# Altium project Dashcam.PrjPcb (part 8 of 8)

## Sheet MICROSD.SchDoc
size A4; SheetNumber: 22; SheetTotal: 22
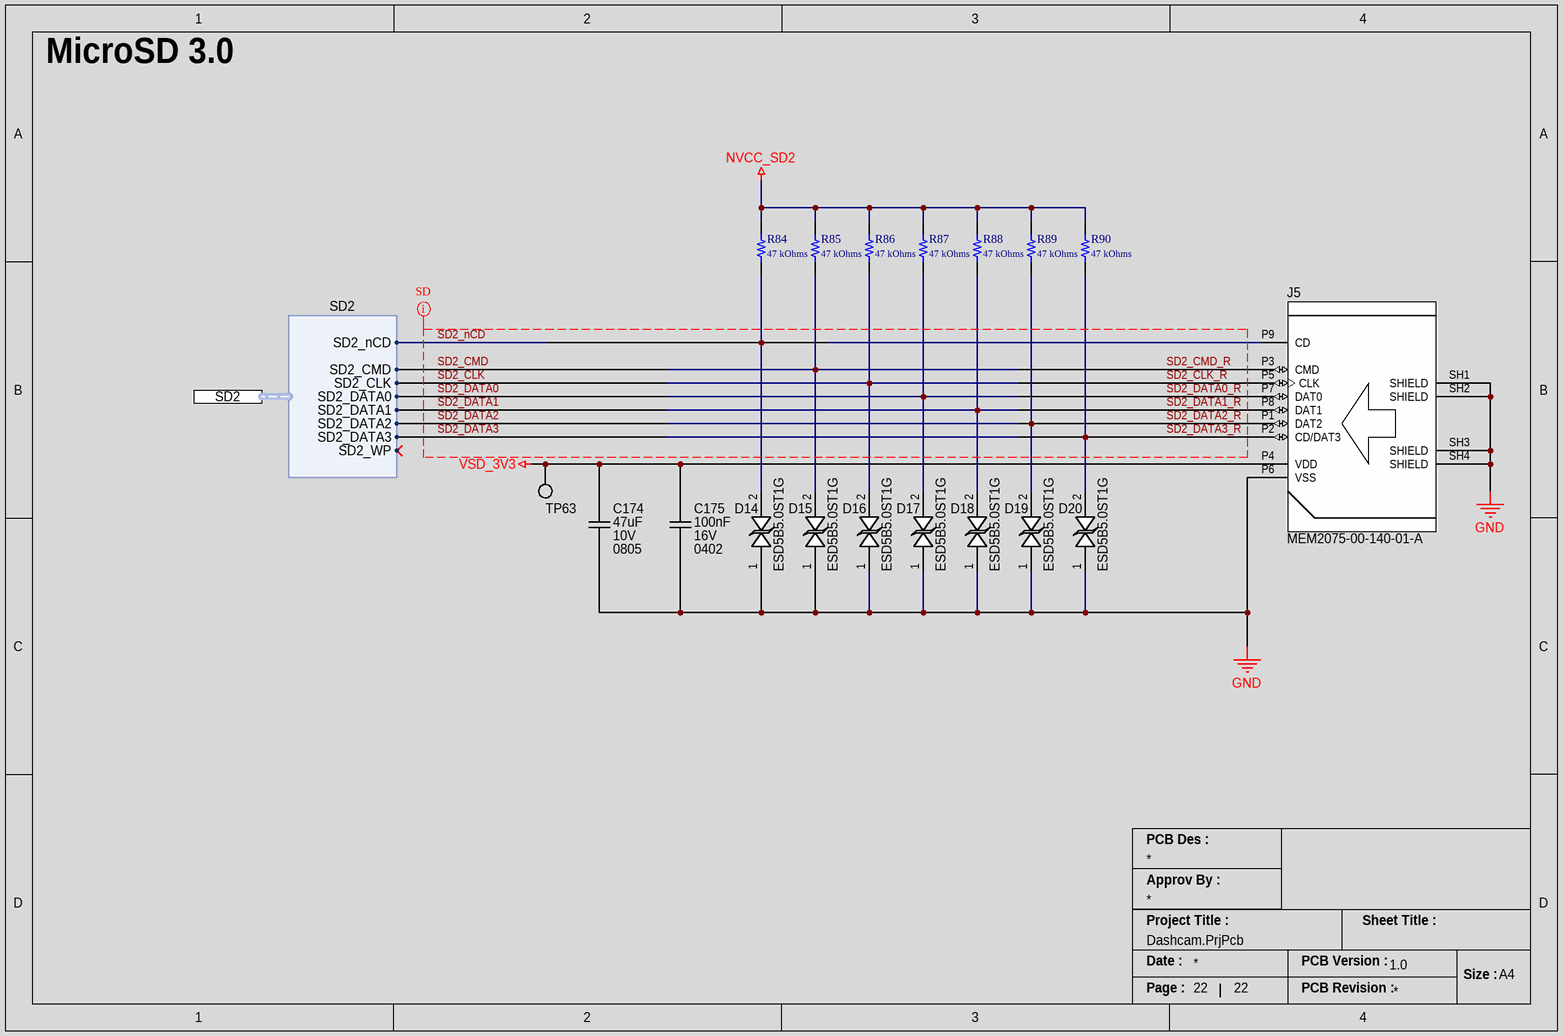
[diagram p20: MICROSD.SchDoc]

### Parts
C174  Voltage Rating (DC): 10V  Capacitance: 47uF  Case Code (Imperial): 0805  [CAP_0805_CAPC2012X12N]  (hidden comment: C2012X5R1A476M125AC)
C175  Voltage Rating: 16V  Capacitance: 100nF  Case/Package: 0402  [CAP_0402_CAPC1005X05N]  (hidden comment: CL05B104KO5NNNC)
D14  ESD5B5.0ST1G  [DIO_TVS_SODFL1608X70N]
D15  ESD5B5.0ST1G  [DIO_TVS_SODFL1608X70N]
D16  ESD5B5.0ST1G  [DIO_TVS_SODFL1608X70N]
D17  ESD5B5.0ST1G  [DIO_TVS_SODFL1608X70N]
D18  ESD5B5.0ST1G  [DIO_TVS_SODFL1608X70N]
D19  ESD5B5.0ST1G  [DIO_TVS_SODFL1608X70N]
D20  ESD5B5.0ST1G  [DIO_TVS_SODFL1608X70N]
J5  MEM2075-00-140-01-A  [CONN_MICROSD_GCT_MEM2075-00-140-01-A]
R84  47 kOhms  [YAGEO RES 0402_1005]
R85  47 kOhms  [YAGEO RES 0402_1005]
R86  47 kOhms  [YAGEO RES 0402_1005]
R87  47 kOhms  [YAGEO RES 0402_1005]
R88  47 kOhms  [YAGEO RES 0402_1005]
R89  47 kOhms  [YAGEO RES 0402_1005]
R90  47 kOhms  [YAGEO RES 0402_1005]
TP63  NO COMPONENT  [TP_PAD_0.5MM_SMD_ROUND]  (value not drawn)  (no BOM)

### Ports
SD2 (harness SD2)

### Harnesses
SD2: SD2_nCD, SD2_CMD, SD2_CLK, SD2_DATA0, SD2_DATA1, SD2_DATA2, SD2_DATA3, SD2_WP

### Nets
GND: C174.1 C175.1 D14.1(A1) D15.1(A1) D16.1(A1) D17.1(A1) D18.1(A1) D19.1(A1) D20.1(A1) J5.P6(VSS) J5.SH1(SHIELD) J5.SH2(SHIELD) J5.SH3(SHIELD) J5.SH4(SHIELD)
NVCC_SD2: R84.2 R85.2 R86.2 R87.2 R88.2 R89.2 R90.2
VSD_3V3: C174.2 C175.2 J5.P4(VDD) TP63.1
SD2_CLK: D16.2(A2) J5.P5(CLK) R86.1 ; port SD2.SD2_CLK  [also labelled SD2_CLK_R]
SD2_CMD: D15.2(A2) J5.P3(CMD) R85.1 ; port SD2.SD2_CMD  [also labelled SD2_CMD_R]
SD2_DATA0: D17.2(A2) J5.P7(DAT0) R87.1 ; port SD2.SD2_DATA0  [also labelled SD2_DATA0_R]
SD2_DATA1: D18.2(A2) J5.P8(DAT1) R88.1 ; port SD2.SD2_DATA1  [also labelled SD2_DATA1_R]
SD2_DATA2: D19.2(A2) J5.P1(DAT2) R89.1 ; port SD2.SD2_DATA2  [also labelled SD2_DATA2_R]
SD2_DATA3: D20.2(A2) J5.P2(CD/DAT3) R90.1 ; port SD2.SD2_DATA3  [also labelled SD2_DATA3_R]
SD2_nCD: D14.2(A2) J5.P9(CD) R84.1 ; port SD2.SD2_nCD

### Layout directives
net class MICROSD: SD2_CLK, SD2_CLK_R, SD2_CMD, SD2_CMD_R, SD2_DATA0, SD2_DATA0_R, SD2_DATA1, SD2_DATA1_R, SD2_DATA2, SD2_DATA2_R, SD2_DATA3, SD2_DATA3_R, SD2_nCD

### Notes on the sheet
- MicroSD 3.0
- (near J5) Micro-SD
- (near J5) # Push-Push
- PCB Des :
- Approv By :
- Project Title :
- Sheet Title :
- Date :
- PCB Version :
- Size :
- A4
- Page :
- PCB Revision :

### Library data of the parts
C174 = CAP_47UF_10V_X5R_0805: Multilayer Ceramic Capacitor, 47 uF, 10 V, ± 20%, X5R, 0805 [2012 Metric]; Manufacturer: TDK; Material: 4241ConductorMaterial; Supplier 1: Digikey; Manufacturer Part Number: C2012X5R1A476M125AC; RoHS: Yes; Category: Ceramic Capacitors; Stock 1: 476295; Pricing 1: 1=0.79, 10=0.572, 50=0.5006, 100=0.4079, 500=0.33372, 1000=0.28737 (USD); Mount: Surface Mount; Case/Package: 0805; Dielectric Material: Ceramic; Case Code (Metric): 2012; Weight: 0.000194oz; Min Operating Temperature: -55°C; Max Operating Temperature: 85°C; Tolerance: 20%; Packaging: Tape and Reel; Dielectric: X5R; Package Quantity: 1; Voltage Rating: 10V; Termination: SMD/SMT; Voltage: 10V; Series: C; Length: 2mm; Width: 0.049inch; Height: 1.25mm; Depth: 1.25mm; Thickness: 0.057inch; Lead Free: Lead Free; Reach SVHC Compliant: No; RoHS Compliant: Yes; ComponentLink1URL: https://datasheet.ciiva.com/24216/c2012x5r1a476m125ac-264921-24216523.pdf?src-supplier=Mouser; ComponentLink1Description: https://datasheet.ciiva.com/24216/c2012x5r1a476m125ac-264921-24216523.pdf?src-supplier=Mouser; ComponentLink2URL: https://datasheet.ciiva.com/24191/c2012x5r1a476m125ac-24191773.pdf?src-supplier=Future+Electronics; ComponentLink2Description: https://datasheet.ciiva.com/24191/c2012x5r1a476m125ac-24191773.pdf?src-supplier=Future+Electronics; ComponentLink3URL: https://datasheet.ciiva.com/7975/1796654-7975085.pdf?src-supplier=Element14; ComponentLink3Description: https://datasheet.ciiva.com/7975/1796654-7975085.pdf?src-supplier=Element14; ComponentLink4URL: https://datasheet.ciiva.com/22694/1796654-22694142.pdf?src-supplier=Element14; ComponentLink4Description: https://datasheet.ciiva.com/22694/1796654-22694142.pdf?src-supplier=Element14; ComponentLink5URL: https://datasheet.ciiva.com/6259/tdkmlcccaprange-6259576.pdf?src-supplier=Digikey; ComponentLink5Description: https://datasheet.ciiva.com/6259/tdkmlcccaprange-6259576.pdf?src-supplier=Digikey; ComponentLink6URL: https://datasheet.ciiva.com/6259/tdkmlcccaprange-6259575.pdf?src-supplier=Digikey; ComponentLink6Description: https://datasheet.ciiva.com/6259/tdkmlcccaprange-6259575.pdf?src-supplier=Digikey; ComponentLink7URL: https://datasheet.ciiva.com/6259/tdkmlcccaprange-6259577.pdf?src-supplier=Digikey; ComponentLink7Description: https://datasheet.ciiva.com/6259/tdkmlcccaprange-6259577.pdf?src-supplier=Digikey; Supplier Part Number 1: 445-8239-6-ND
C175 = CAP_100NF_16V_X7R_0402: Multilayer Ceramic Capacitor, 0.1 uF, 16 V, ± 10%, X7R, 0402 [1005 Metric]; Manufacturer: Samsung; Supplier 1: Digi-Key; Manufacturer Part Number: CL05B104KO5NNNC; RoHS: Yes; Category: Ceramic Capacitors; Stock 1: 11081064; Pricing 1: 1=0.1, 10=0.024, 50=0.013, 100=0.0105, 500=0.00752, 1000=0.00592, 2500=0.00538, 5000=0.00495 (USD); Mount: Surface Mount; Case Code (Metric): 1005; Case Code (Imperial): 0402; Material: Ceramic; Min Operating Temperature: -55°C; Max Operating Temperature: 125°C; Tolerance: 10%; Package Quantity: 1; Packaging: Tape and Reel; Dielectric: X7R; Series: CL; Voltage: 16V; Voltage Rating (DC): 16V; Construction: Flat; Length: 1mm; Width: 0.02inch; Height: 0.5mm; Thickness: 0.022inch; Depth: 0.5mm; Radiation Hardening: No; RoHS Compliant: Yes; Lead Free: Lead Free; ComponentLink1URL: https://datasheet.ciiva.com/26920/getdatasheetpartid-359683-26920169.pdf?src-supplier=Verical; ComponentLink1Description: https://datasheet.ciiva.com/26920/getdatasheetpartid-359683-26920169.pdf?src-supplier=Verical; ComponentLink2URL: https://datasheet.ciiva.com/29198/458718-da-01-en-vs-kondensator-0402-29198423.pdf?src-supplier=Conrad; ComponentLink2Description: https://datasheet.ciiva.com/29198/458718-da-01-en-vs-kondensator-0402-29198423.pdf?src-supplier=Conrad; ComponentLink3URL: https://datasheet.ciiva.com/16208/cl05b104kq5nnnc-16208343.pdf?src-supplier=Future+Electronics; ComponentLink3Description: https://datasheet.ciiva.com/16208/cl05b104kq5nnnc-16208343.pdf?src-supplier=Future+Electronics; ComponentLink4URL: https://datasheet.ciiva.com/26309/mlcc-catalogdownload2013-eng-26309003.pdf?src-supplier=Distrelec; ComponentLink4Description: https://datasheet.ciiva.com/26309/mlcc-catalogdownload2013-eng-26309003.pdf?src-supplier=Distrelec; Supplier Part Number 1: 1276-1001-6-ND
D14-D20 = DIO_TVS_5.8V_ESD5B5.0ST1G_1: ESD5B5.0S Series 5.8 V 50 W 32 pF SMT ESD Protection Diode - SOD-523
J5 = CONN_MICROSD_MEM2075-00-140-01-A: Memory Card Connectors Micro SD Push-Push, SMT, 1.40mm Profile, With Peg, Open Switch, T&R; Manufacturer: Global Connector Technology; Supplier 1: Verical; Manufacturer Part Number: MEM2075-00-140-01-A; RoHS: No; Category: Connectors; Stock 1: 1000; Pricing 1: 1000=1.6923 (USD); Mount: Surface Mount; Number of Pins: 8NUMBER; Contact Plating: Gold; Housing Material: 4896ConductorMaterial; Connector Type: Connector; Series: MEM2075; Packaging: Tape and Reel; ComponentLink1URL: https://gct.co/files/drawings/mem2075.pdf?src-supplier=Digikey; ComponentLink1Description: https://gct.co/files/drawings/mem2075.pdf?src-supplier=Digikey; ComponentLink2URL: https://datasheet.octopart.com/MEM2075-00-140-01-A-GCT-datasheet-166929309.pdf?src-supplier=TME; ComponentLink2Description: https://datasheet.octopart.com/MEM2075-00-140-01-A-GCT-datasheet-166929309.pdf?src-supplier=TME; Supplier Part Number 1: MEM2075-00-140-01-A
R84-R90 = AC0402JR-0747KL: RES SMD 47K OHM 5% 1/16W 0402; Manufacturer: Yageo; Power (Watts): 0.063W, 1/16W; Temperature Coefficient: ±100ppm/°C; Part Number: AC0402JR-0747KL; Value: 47 kOhms; ComponentLink1Description: Datasheet; ComponentLink1URL: https://www.yageo.com/upload/media/product/productsearch/datasheet/rchip/PYu-AC_51_RoHS_L_7.pdf; ComponentLink2Description: DigiKey Link; ComponentLink2URL: https://www.digikey.com/en/products/detail/yageo/AC0402JR-0747KL/5895679; Composition: Thick Film; Device Package: 0402 (1005 Metric); Features: Automotive AEC-Q200, Moisture Resistant; Height - Seated (Max): 0.015" (0.37mm); LastUpdated: 7/25/2024 9:18:18 AM; Lifecycle Status: Active; Minimum Order: 1; Number of Terminations: 2; Operating Temperature: -55°C ~ 155°C; Package / Case: 0402 (1005 Metric); Packaging: CutTape; PartId: 3385; Part Status: Active; Price: 0.01; Ratings: AEC-Q200; Resistance: 47 kOhms; Series: AC; Size / Dimension: 0.039" L x 0.020" W (1.00mm x 0.50mm); Supplier 1: DigiKey; Supplier Part Number 1: YAG3547CT-ND; Supplier Device Package: 0402; Tolerance: ±5%
TP63 = TP_PAD_SMD_SMALL: Test Point, SMD pad, round, 1.5mm, 1.6mm, 3mm diameter

## Nets that join several sheets
GND: CPU IO (C70.1 Q1.S), CPU PHY (6 pins), CPU MISC (8 pins), CPU Power (173 pins), Connector A (5 pins), Converter (40 pins), DBG (15 pins), GNSS_GPS (16 pins), IMU (14 pins), MAIN_POWER (16 pins), CAMERA (26 pins), WIFI_BLE (74 pins), MICROSD (14 pins)
NVCC_DRAM_1V1: CPU Power (18 pins), Converter (5 pins)
NVCC_SD2: CPU IO (R22.1 R23.1 R24.1), CPU Power (C17.2 U1.W24), Converter (C120.1 TP44.1 U5.55), MICROSD (7 pins)
NVCC_SNVS_1V8: CPU MISC (R9.2 R10.2 R11.2), CPU Power (C5.2 U1.R24), Converter (C106.1 R40.1 TP38.1 U5.3)
VDD_1V8: CPU IO (6 pins), CPU Power (22 pins), Connector A (C136.2), Converter (6 pins), DBG (15 pins)
VDD_3V3: CPU IO (R15.2), CPU Power (C18.2 U1.J14), Connector A (C135.2), Converter (7 pins), WIFI_BLE (7 pins)
VDD_ARM: CPU Power (26 pins), Converter (6 pins)
VDD_SOC: CPU Power (64 pins), Converter (9 pins)
VDDA_1V8: CPU Power (24 pins), Converter (C114.2 TP41.1 U5.54)
VEXT_3V3: DBG (6 pins), CAMERA (6 pins)
VSD_3V3: Connector A (C137.2), Converter (C128.2 U5.23), MICROSD (C174.2 C175.2 J5.P4 TP63.1)
VSYS_5V: Connector A (C133.2 C134.2 TP56.1), Converter (21 pins), MAIN_POWER (9 pins)
BOOT_MODE0: CPU MISC (U1.G10), DBG (R?#20.2 SW?.4 TP37.1)
BOOT_MODE1: CPU MISC (U1.F8), DBG (R?#21.2 SW?.3 TP36.1)
DBG_UART_A53_RX: CPU IO (U1.AF6), DBG (R?#9.1 TP34.1 U?.3)
DBG_UART_A53_TX: CPU IO (U1.AH4), DBG (R?#10.1 TP35.1 U?.2)
DBG_UART_M7_RX: CPU IO (U1.AJ5), DBG (R?#8.1 TP33.1 U?.4)
DBG_UART_M7_TX: CPU IO (U1.AH5), DBG (R?#7.1 TP32.1 U?.5)
I2C1_SCL: CPU IO (R16.2 U1.AC8), Converter (R46.1)
I2C1_SDA: CPU IO (R17.2 U1.AH7), Converter (R48.1)
PMIC_nINT: CPU IO (U1.D6), Converter (U5.13)
PMIC_ON_REQ: CPU MISC (R9.1 TP12.1 U1.F22), Converter (R42.1)
PMIC_STBY_REQ: CPU MISC (TP13.1 U1.J24), Converter (R43.1)
POR_B: CPU MISC (R10.1 TP11.1 U1.J29), Converter (R47.2)
SD2_VSEL: CPU IO (U1.E6), Converter (U5.29)
USB1_D_N: CPU PHY (U1.E10), DBG (TP30.1)
USB1_D_P: CPU PHY (U1.D10), DBG (TP29.1)
USB1_VBUS_3V3: CPU PHY (U1.A11), DBG (TP31.1)
WDOG_B: CPU IO (U1.B6), Converter (R44.1 TP54.1)

## Assembly variants
Base Variant: all parts fitted